# Altium schematic sheet [10] - Slave_PLCModule.SchDoc: =ProjectName
size A4; CheckedBy: Ven; Author: Ven; CompanyName: HUST; Revision: V.1.0
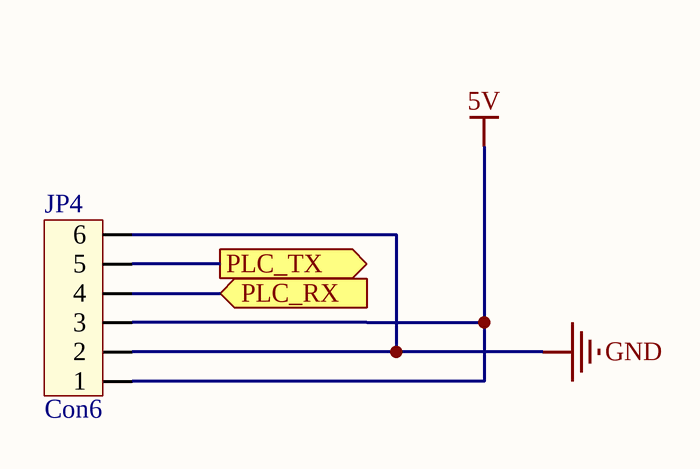
[diagram p0: [10] - Slave_PLCModule.SchDoc]

## Parts
JP4  Con6  [CON6]

## Ports
PLC_RX (in), PLC_TX (out)

## Nets
5V: JP4.1 JP4.3
GND: JP4.2 JP4.6
PLC_RX: JP4.4 ; port PLC_RX
PLC_TX: JP4.5 ; port PLC_TX

## Notes on the sheet
- Project:
- Page Contents:
- Size:
- Date:
- A4
- Checked by:
- Time:
- Revision:
- Sheet
- of
- File:

## Library data of the parts
JP4 = Con6: PLC module; Value: Connector 6